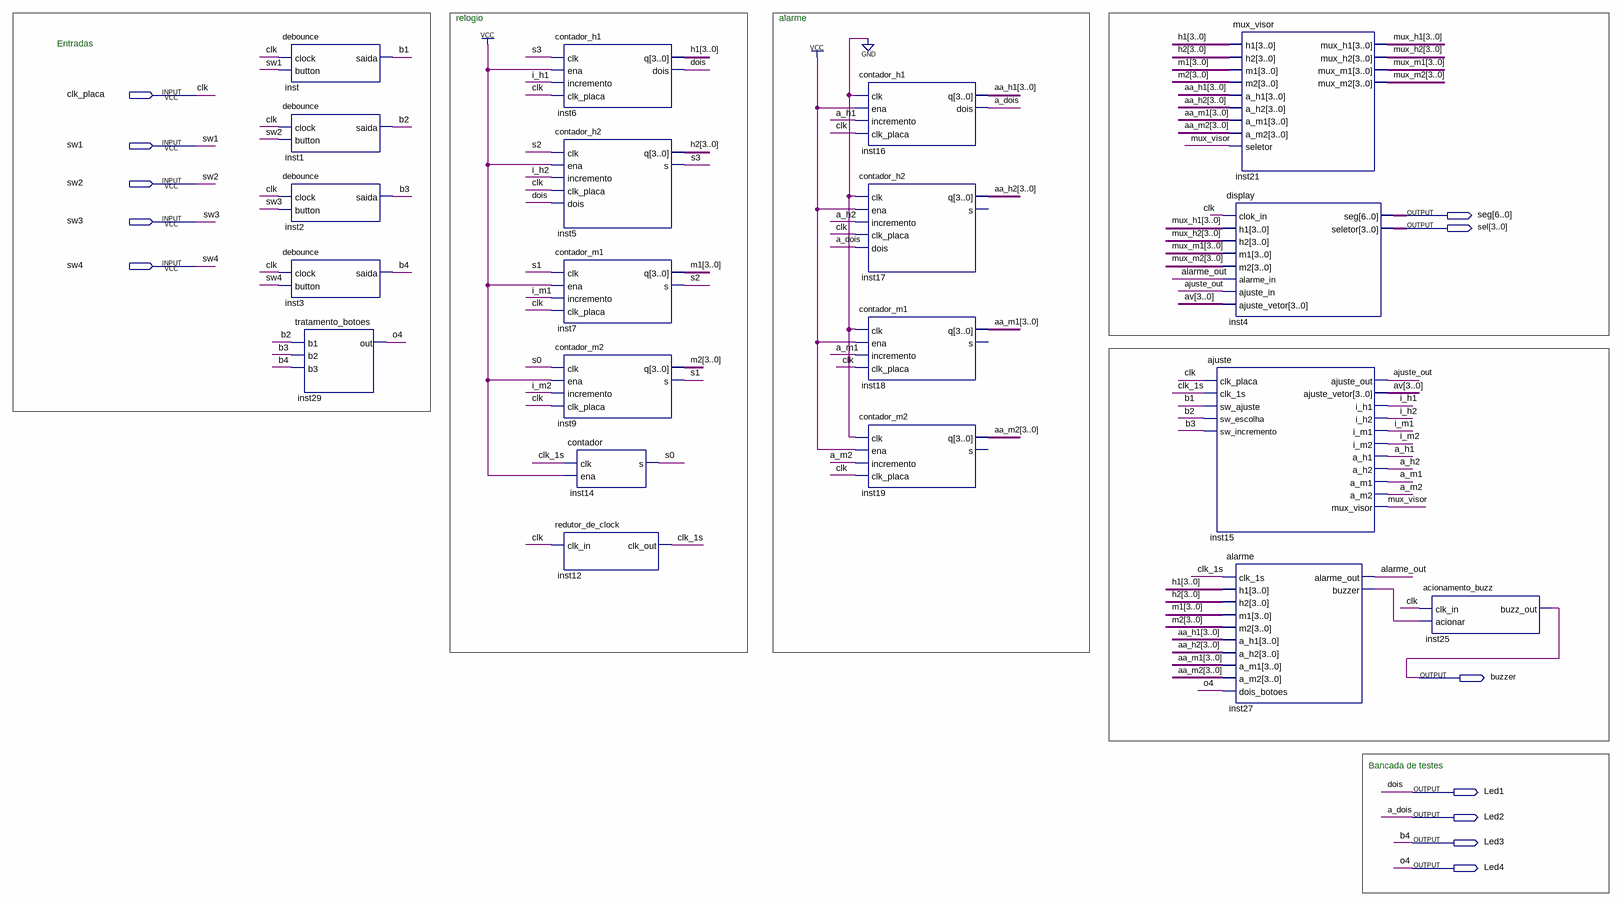
[diagram p0: schematic sheet]
// Quartus schematic Projeto_2_Blocks.bdf as structural Verilog: 20 symbols, 12 pins
module Projeto_2_Blocks (
  input  clk_placa,
  input  sw1,
  input  sw2,
  input  sw3,
  input  sw4,
  output [6:0] seg,
  output [3:0] sel,
  output buzzer,
  output Led1,
  output Led2,
  output Led3,
  output Led4
);

  wire a_h1, a_h2, a_m1, a_m2, ajuste_out, alarme_out, b1, b2, b3, clk_1s, i_h1, i_h2, i_m1, i_m2,
       inst27_buzzer, mux_visor, s0, s1, s2, s3;
  wire [3:0] aa_h1, aa_h2, aa_m1, aa_m2, av, h1, h2, m1, m2, mux_h1, mux_h2, mux_m1, mux_m2;

  debounce inst (.clock(clk_placa), .button(sw1), .saida(b1));
  debounce inst1 (.clock(clk_placa), .button(sw2), .saida(b2));
  debounce inst2 (.clock(clk_placa), .button(sw3), .saida(b3));
  debounce inst3 (.clock(clk_placa), .button(sw4), .saida(Led3));
  tratamento_botoes inst29 (.b1(b2), .b2(b3), .b3(Led3), .out(Led4));
  contador_h1 inst6 (.clk(s3), .ena(1'b1), .incremento(i_h1), .clk_placa(clk_placa), .q(h1), .dois(Led1));
  contador_h2 inst5 (.clk(s2), .ena(1'b1), .incremento(i_h2), .clk_placa(clk_placa), .dois(Led1), .q(h2), .s(s3));
  contador_m1 inst7 (.clk(s1), .ena(1'b1), .incremento(i_m1), .clk_placa(clk_placa), .q(m1), .s(s2));
  contador_m2 inst9 (.clk(s0), .ena(1'b1), .incremento(i_m2), .clk_placa(clk_placa), .q(m2), .s(s1));
  redutor_de_clock inst12 (.clk_in(clk_placa), .clk_out(clk_1s));
  contador inst14 (.clk(clk_1s), .ena(1'b1), .s(s0));
  contador_h1 inst16 (.clk(1'b0), .ena(1'b1), .incremento(a_h1), .clk_placa(clk_placa), .q(aa_h1), .dois(Led2));
  contador_h2 inst17 (
    .clk(1'b0), .ena(1'b1), .incremento(a_h2), .clk_placa(clk_placa), .dois(Led2), .q(aa_h2));  // open: s
  contador_m1 inst18 (.clk(1'b0), .ena(1'b1), .incremento(a_m1), .clk_placa(clk_placa), .q(aa_m1));  // open: s
  contador_m2 inst19 (.clk(1'b0), .ena(1'b1), .incremento(a_m2), .clk_placa(clk_placa), .q(aa_m2));  // open: s
  ajuste inst15 (
    .clk_placa(clk_placa), .clk_1s(clk_1s), .sw_ajuste(b1), .sw_escolha(b2), .sw_incremento(b3),
    .ajuste_out(ajuste_out), .ajuste_vetor(av), .i_h1(i_h1), .i_h2(i_h2), .i_m1(i_m1), .i_m2(i_m2),
    .a_h1(a_h1), .a_h2(a_h2), .a_m1(a_m1), .a_m2(a_m2), .mux_visor(mux_visor));
  mux_visor inst21 (
    .h1(h1), .h2(h2), .m1(m1), .m2(m2), .a_h1(aa_h1), .a_h2(aa_h2), .a_m1(aa_m1), .a_m2(aa_m2),
    .seletor(mux_visor), .mux_h1(mux_h1), .mux_h2(mux_h2), .mux_m1(mux_m1), .mux_m2(mux_m2));
  display inst4 (
    .clok_in(clk_placa), .h1(mux_h1), .h2(mux_h2), .m1(mux_m1), .m2(mux_m2), .alarme_in(alarme_out),
    .ajuste_in(ajuste_out), .ajuste_vetor(av), .seg(seg), .seletor(sel));
  alarme inst27 (
    .clk_1s(clk_1s), .h1(h1), .h2(h2), .m1(m1), .m2(m2), .a_h1(aa_h1), .a_h2(aa_h2), .a_m1(aa_m1),
    .a_m2(aa_m2), .dois_botoes(Led4), .alarme_out(alarme_out), .buzzer(inst27_buzzer));
  acionamento_buzz inst25 (.clk_in(clk_placa), .acionar(inst27_buzzer), .buzz_out(buzzer));

  // Other names for the same wires on the sheet: a_dois = Led2; b4 = Led3; clk = clk_placa; dois = Led1; o4 = Led4

  // Notes on the sheet:
  //   relogio
  //   alarme
  //   Entradas
  //   Bancada de testes
endmodule
